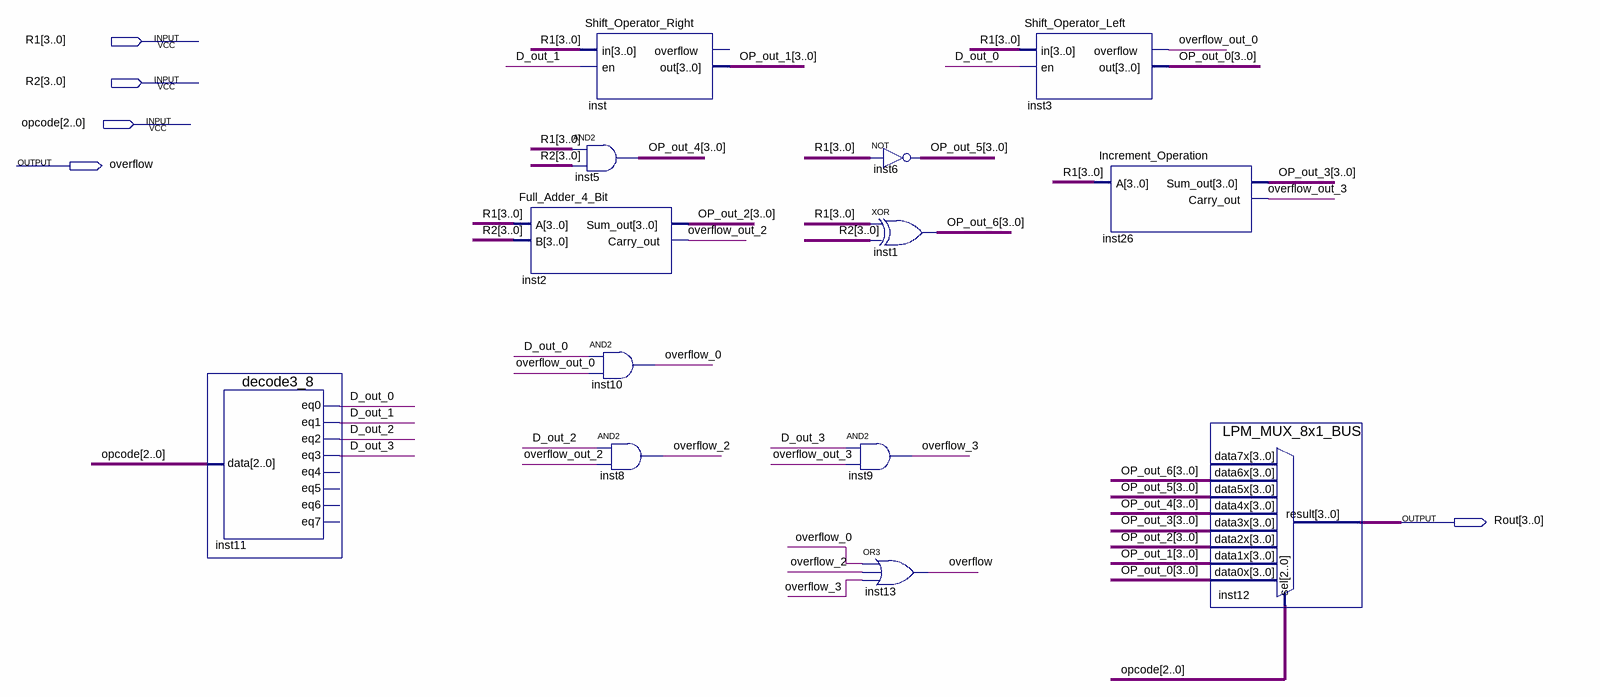
[diagram p0: schematic sheet]
// Quartus schematic ALU_2020510014_2020510028_2021510022.bdf as structural Verilog: 13 symbols, 5 pins
module ALU_2020510014_2020510028_2021510022 (
  input  [3:0] R1,
  input  [3:0] R2,
  input  [2:0] opcode,
  output overflow,
  output [3:0] Rout
);

  wire D_out_0, D_out_1, D_out_2, D_out_3, overflow_0, overflow_2, overflow_3, overflow_out_0,
       overflow_out_2, overflow_out_3;
  wire [3:0] OP_out_0, OP_out_1, OP_out_2, OP_out_3, OP_out_4, OP_out_5, OP_out_6;

  decode3_8 inst11 (
    .data(opcode), .eq0(D_out_0), .eq1(D_out_1), .eq2(D_out_2), .eq3(D_out_3));  // open: eq4, eq5, eq6, eq7
  Full_Adder_4_Bit inst2 (.A(R1), .B(R2), .Sum_out(OP_out_2), .Carry_out(overflow_out_2));
  Shift_Operator_Right inst (.in(R1), .en(D_out_1), .out(OP_out_1));  // open: overflow
  assign OP_out_4 = R1 & R2;  // AND2 inst5, 4 bits wide
  and inst10 (overflow_0, D_out_0, overflow_out_0);
  and inst8 (overflow_2, D_out_2, overflow_out_2);
  assign OP_out_5 = ~R1;  // NOT inst6, 4 bits wide
  assign OP_out_6 = R1 ^ R2;  // XOR inst1, 4 bits wide
  and inst9 (overflow_3, D_out_3, overflow_out_3);
  or inst13 (overflow, overflow_0, overflow_2, overflow_3);
  Shift_Operator_Left inst3 (.in(R1), .en(D_out_0), .overflow(overflow_out_0), .out(OP_out_0));
  Increment_Operation inst26 (.A(R1), .Sum_out(OP_out_3), .Carry_out(overflow_out_3));
  LPM_MUX_8x1_BUS inst12 (
    .data6x(OP_out_6), .data5x(OP_out_5), .data4x(OP_out_4), .data3x(OP_out_3), .data2x(OP_out_2),
    .data1x(OP_out_1), .data0x(OP_out_0), .sel(opcode), .result(Rout));  // open: data7x
endmodule
